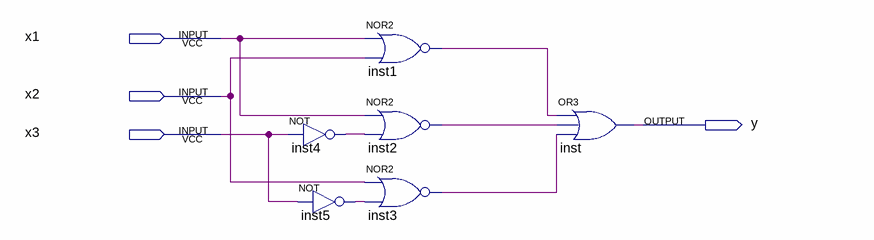
[diagram p0: schematic sheet]
// Quartus schematic LC1_Prishchepa.bdf as structural Verilog: 6 symbols, 4 pins
module LC1_Prishchepa (
  input  x1,
  input  x2,
  input  x3,
  output y
);

  wire inst1_out, inst2_out, inst3_out, inst4_out, inst5_out;

  not inst4 (inst4_out, x3);
  not inst5 (inst5_out, x3);
  nor inst1 (inst1_out, x1, x2);
  nor inst2 (inst2_out, x1, inst4_out);
  nor inst3 (inst3_out, x2, inst5_out);
  or inst (y, inst1_out, inst2_out, inst3_out);
endmodule
